# Altium schematic sheet Sheet1.SchDoc
size Letter
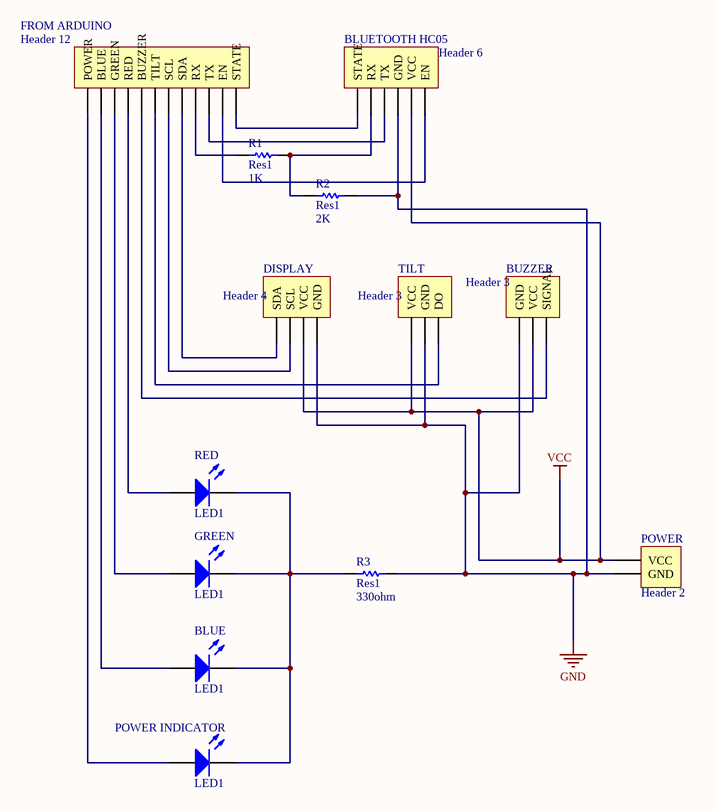
[diagram p0: Sheet1.SchDoc]

## Parts
BLUE  LED1  [LED-1]
BLUETOOTH_HC05  Header 6  [HDR1X6]
BUZZER  Header 3  [HDR1X3]
DISPLAY  Header 4  [HDR1X4]
FROM_ARDUINO  Header 12  [HDR1X12]
GREEN  LED1  [LED-1]
POWER  Header 2  [HDR1X2]
POWER_INDICATOR  LED1  [LED-1]
R1  Res1  value 1K  [AXIAL-0.3]
R2  Res1  value 2K  [AXIAL-0.3]
R3  Res1  value 330ohm  [AXIAL-0.3]
RED  LED1  [LED-1]
TILT  Header 3  [HDR1X3]

## Nets
GND: BLUETOOTH_HC05.4(GND) BUZZER.1(GND) DISPLAY.4(GND) POWER.2(GND) R2.2 R3.2 TILT.2(GND)
VCC: BLUETOOTH_HC05.5(VCC) BUZZER.2(VCC) DISPLAY.3(VCC) POWER.1(VCC) TILT.1(VCC)
NetBLUE_1: BLUE.1(A) FROM_ARDUINO.2(BLUE)
NetBLUE_2: BLUE.2(K) GREEN.2(K) POWER_INDICATOR.2(K) R3.1 RED.2(K)
NetBLUETOOTH_HC05_1: BLUETOOTH_HC05.1(STATE) FROM_ARDUINO.12(STATE)
NetBLUETOOTH_HC05_2: BLUETOOTH_HC05.2(RX) R1.2 R2.1
NetBLUETOOTH_HC05_3: BLUETOOTH_HC05.3(TX) FROM_ARDUINO.10(TX)
NetBLUETOOTH_HC05_6: BLUETOOTH_HC05.6(EN) FROM_ARDUINO.11(EN)
NetBUZZER_3: BUZZER.3(SIGNAL) FROM_ARDUINO.5(BUZZER)
NetDISPLAY_1: DISPLAY.1(SDA) FROM_ARDUINO.8(SDA)
NetDISPLAY_2: DISPLAY.2(SCL) FROM_ARDUINO.7(SCL)
NetFROM_ARDUINO_1: FROM_ARDUINO.1(POWER) POWER_INDICATOR.1(A)
NetFROM_ARDUINO_3: FROM_ARDUINO.3(GREEN) GREEN.1(A)
NetFROM_ARDUINO_4: FROM_ARDUINO.4(RED) RED.1(A)
NetFROM_ARDUINO_6: FROM_ARDUINO.6(TILT) TILT.3(DO)
NetFROM_ARDUINO_9: FROM_ARDUINO.9(RX) R1.1

## Library data of the parts
BLUE GREEN POWER_INDICATOR RED = LED1: Typical RED GaAs LED; Published: 8-Jun-2000; LatestRevisionDate: 08-Jul-2005; LatestRevisionNote: Mech Layer 1 removed.; PackageReference: LED-1; Publisher: Altium Limited; PackageDescription: LED; 2 Leads
BLUETOOTH_HC05 = Header 6: Header, 6-Pin; LatestRevisionDate: 17-Jul-2002; LatestRevisionNote: Re-released for DXP Platform.; Publisher: Altium Limited
BUZZER TILT = Header 3: Header, 3-Pin; LatestRevisionDate: 17-Jul-2002; LatestRevisionNote: Re-released for DXP Platform.; Publisher: Altium Limited
DISPLAY = Header 4: Header, 4-Pin; LatestRevisionDate: 17-Jul-2002; LatestRevisionNote: Re-released for DXP Platform.; Publisher: Altium Limited
FROM_ARDUINO = Header 12: Header, 12-Pin; LatestRevisionDate: 17-Jul-2002; LatestRevisionNote: Re-released for DXP Platform.; Publisher: Altium Limited
POWER = Header 2: Header, 2-Pin; LatestRevisionDate: 17-Jul-2002; LatestRevisionNote: Re-released for DXP Platform.; Publisher: Altium Limited
R1-R3 = Res1: Resistor; Published: 8-Jun-2000; LatestRevisionDate: 17-Jul-2002; LatestRevisionNote: Re-released for DXP Platform.; PackageReference: AXIAL-0.3; Publisher: Altium Limited; PackageDescription: Axial Device, Thru-Hole; 2 Leads; 0.3 in Pin Spacing